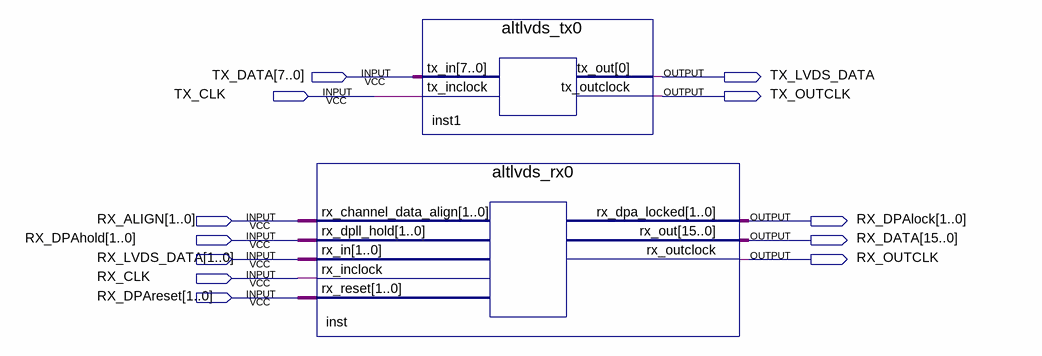
[diagram p0: schematic sheet]
// Quartus schematic lvds_transceivers.bdf as structural Verilog: 2 symbols, 12 pins
module lvds_transceivers (
  input  [7:0] TX_DATA,
  input  TX_CLK,
  input  [1:0] RX_ALIGN,
  input  [1:0] RX_DPAhold,
  input  [1:0] RX_LVDS_DATA,
  input  RX_CLK,
  input  [1:0] RX_DPAreset,
  output TX_LVDS_DATA,
  output TX_OUTCLK,
  output [1:0] RX_DPAlock,
  output [15:0] RX_DATA,
  output RX_OUTCLK
);

  altlvds_rx0 inst (
    .rx_channel_data_align(RX_ALIGN), .rx_dpll_hold(RX_DPAhold), .rx_in(RX_LVDS_DATA), .rx_inclock(RX_CLK),
    .rx_reset(RX_DPAreset), .rx_dpa_locked(RX_DPAlock), .rx_out(RX_DATA), .rx_outclock(RX_OUTCLK));
  altlvds_tx0 inst1 (.tx_in(TX_DATA), .tx_inclock(TX_CLK), .tx_out(TX_LVDS_DATA), .tx_outclock(TX_OUTCLK));
endmodule
